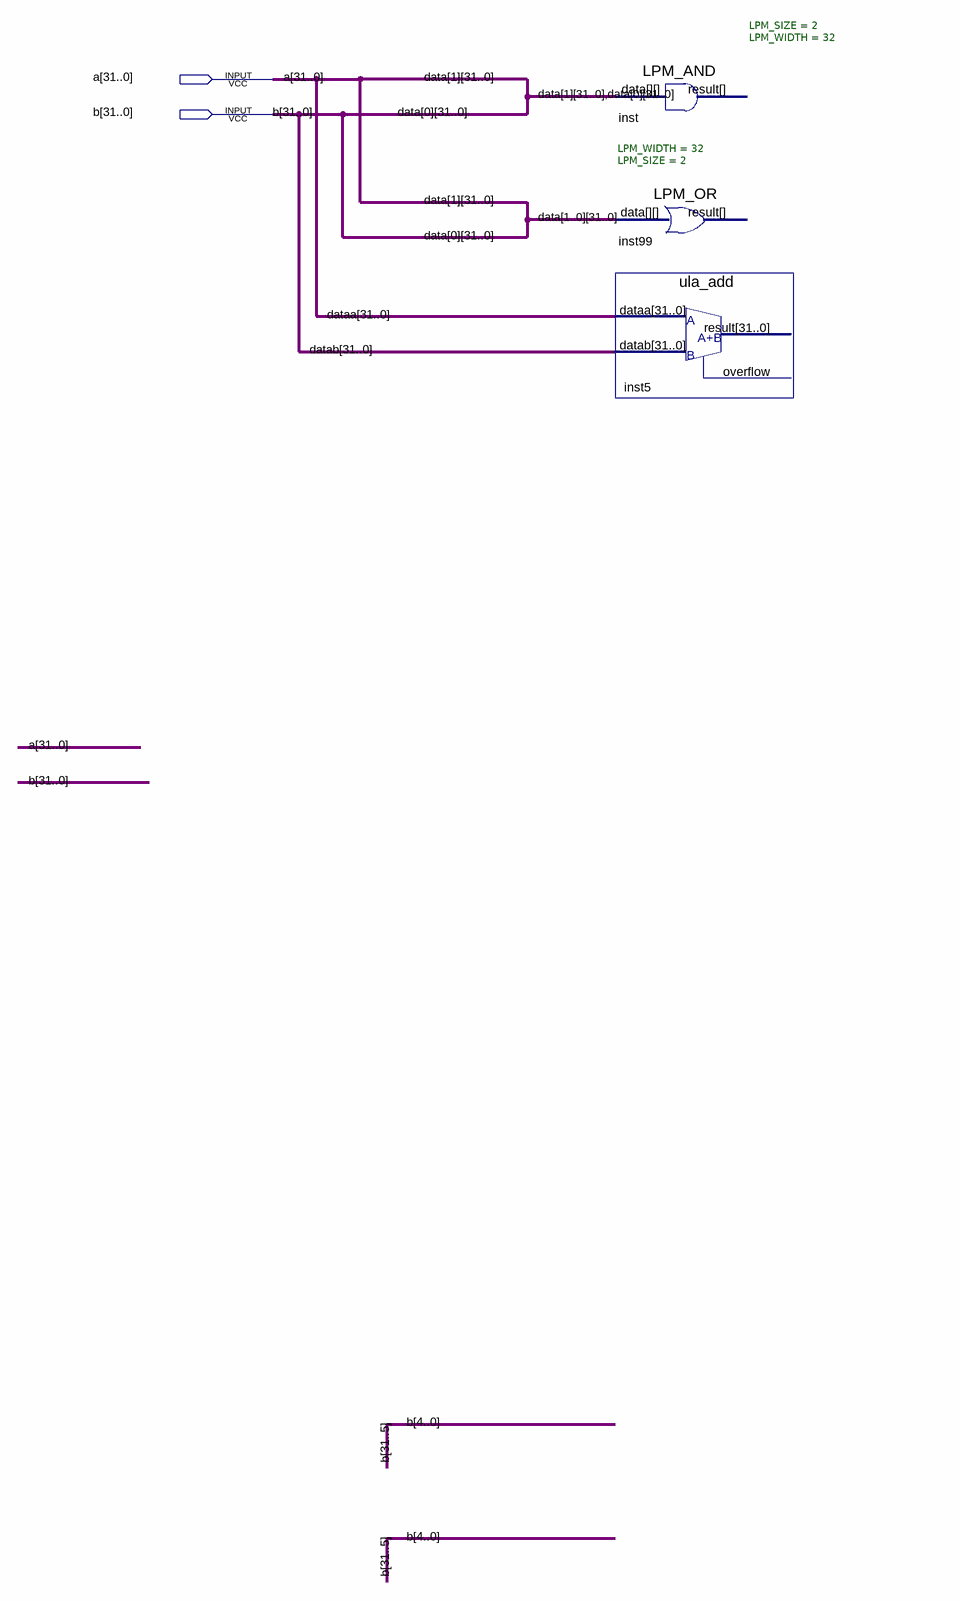
[diagram p0: schematic sheet]
// Quartus schematic test_bus.bdf as structural Verilog: 3 symbols, 2 pins
module test_bus (
  input  [31:0] a,
  input  [31:0] b
);

  wire [31:0] data_0, data_1, dataa, datab;

  LPM_AND #(.LPM_SIZE(2), .LPM_WIDTH(32)) inst (.data({data_1, data_0}));  // open: result
  LPM_OR #(.LPM_WIDTH(32), .LPM_SIZE(2)) inst99 (.data({data_1, data_0}));  // open: result
  ula_add inst5 (.dataa(dataa), .datab(datab));  // open: result, overflow
endmodule
